# EAGLE design LB_BIT_p3_USBPOWER-v02(rev1) (EAGLE 6.6.0)
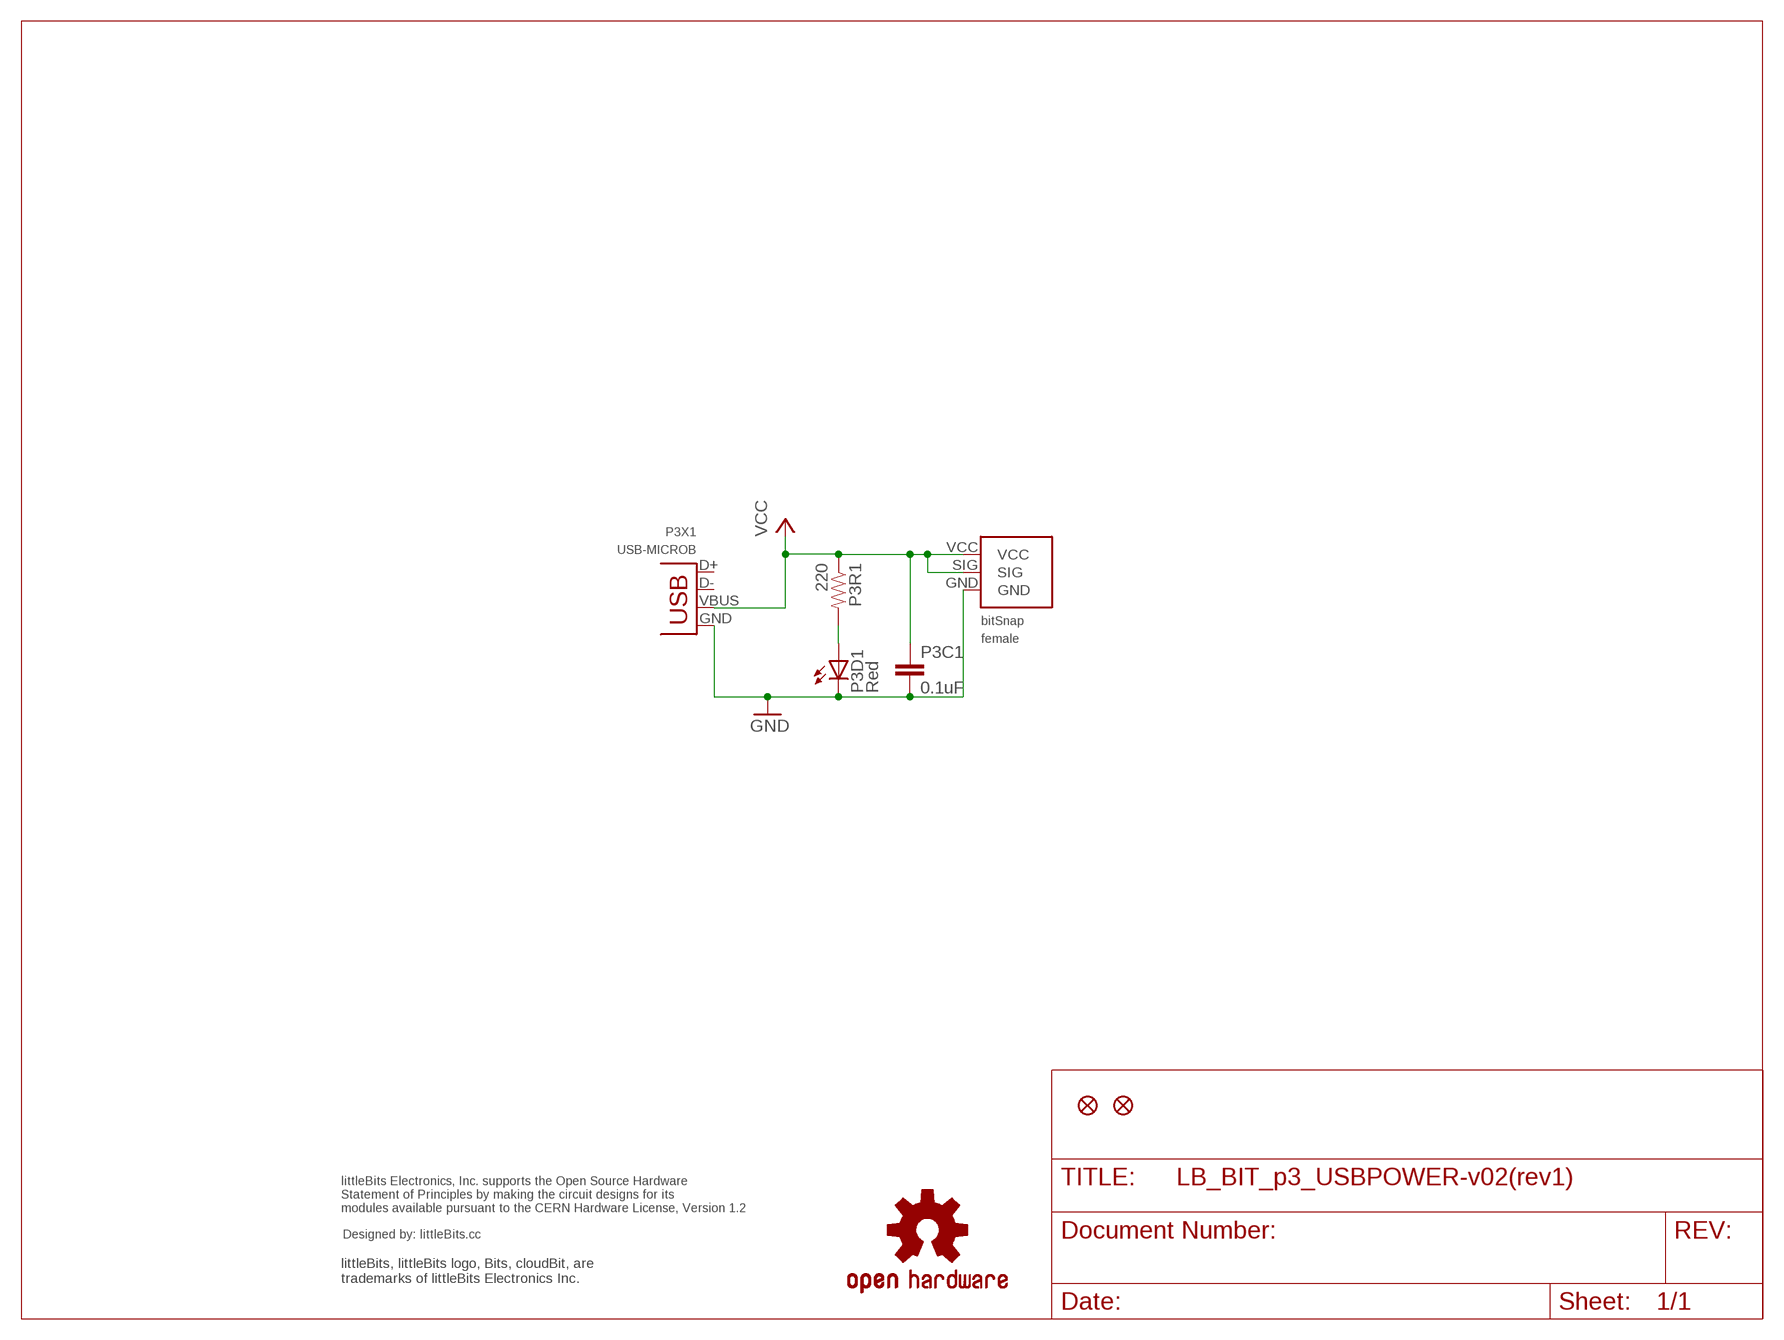
[diagram p0: schematic, sheet 1]

## Parts
P3BSF  BITSNAP_FEMALE  [BITSNAP_FEMALE]
P3C1  0.1uF  CAP0603-CAP  [0603-CAP]
P3D1  Red  LED1206  [LED-1206]
P3FD1  FIDUCIAL1X2  [FIDUCIAL-1X2]
P3FD2  FIDUCIAL1X2  [FIDUCIAL-1X2]
P3R1  220  RESISTOR0603-RES  [0603-RES]
P3X1  USB-MICROB  [USB-MICROB-ZX62-B-5PA(11)]
U$2  OSHWCREDIT  [OSHWCREDIT]
U$3  OSHW-LOGOL  [OSHW-LOGO-L]

## Nets
GND: P3BSF.GND P3C1.2 P3D1.C P3X1.GND
N$1: P3D1.A P3R1.2
VCC: P3BSF.SIG P3BSF.VCC P3C1.1 P3R1.1 P3X1.VBUS
Unconnected: P3X1.D+ P3X1.D-

## Library data of the parts
P3BSF = bitSnap:BITSNAP_FEMALE
P3C1 = SparkFun:CAP: Capacitor Standard 0603 ceramic capacitor, and 0.1" leaded capacitor.
P3D1 = SparkFun:LED: LEDs Standard schematic elements and footprints for 5mm, 3mm, 1206, and 0603 sized LEDs. 5mm - Spark Fun Electronics SKU : COM-00529 (and others)
P3FD1 P3FD2 = SparkFun:FIDUCIAL: Fiducial Alignment Points Various fiducial points for machine vision alignment.
P3R1 = SparkFun:RESISTOR: Resistor Basic schematic elements and footprints for 0603, 1206, and PTH 1/10th watt (small) resistors.
P3X1 = LITTLEBITS:USB-MICROB: Hirose Electric Co Ltd ZX62-B-5PA(11)
U$2 = LITTLEBITS:OSHWCREDIT
U$3 = SparkFun_NEW:OSHW-LOGO: Open Source Hardware Logo This logo indicates the piece of hardware it is found on incorporates a OSHW license and/or adheres to the definition of open source hardware found here: http://freedomdefined.org/OSHW

## Board
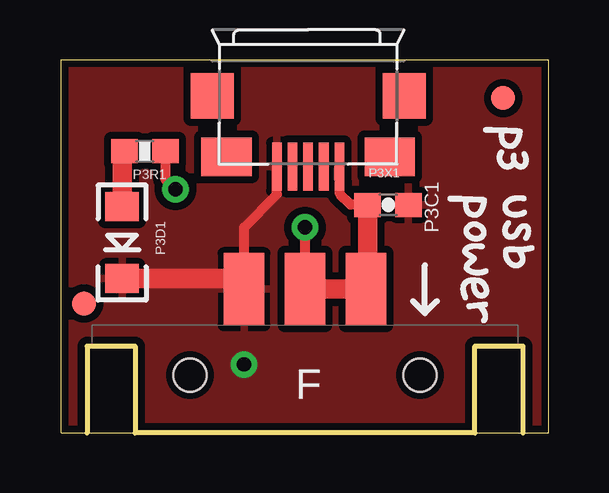
[diagram p1: board, top side]
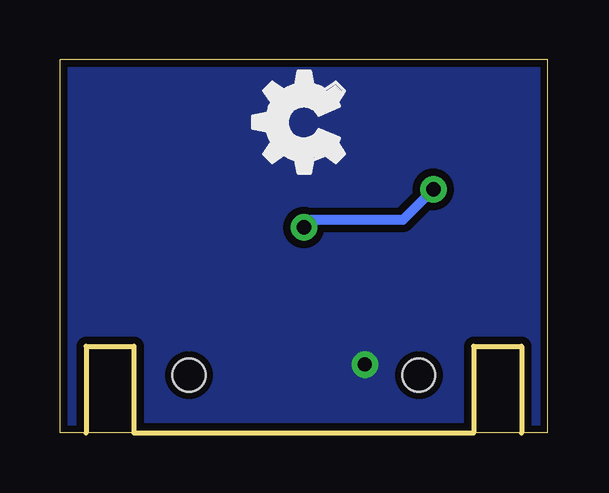
[diagram p2: board, bottom side, seen from below]

Size 20.32 x 15.56 mm. Coordinates in mm from the lower left corner, seen from the top.
Outline: 0,15.56 20.32,15.56 20.32,0 0,0 0,15.56
Copper layers (1*16): Top 0.035mm / dielectric 1.5mm / Bottom 0.035mm
Design rules "default": minimum track width 8mil, minimum drill 20mil, track to track 8mil, track to pad 8mil, pad to pad 8mil, via to via 8mil, smd to smd 8mil, copper to edge 10mil, drill to drill 8mil, minimum pad ring 12mil, minimum via ring 10mil, stop-mask expansion 4mil, vias tented up to drill 25mil, thermal gap 10mil

### Footprints (pad centres in the part's own frame; a part is rotated, then mirrored left to right if it is on the bottom)
BITSNAP_FEMALE = smd 1.7 x 3: GND 6.35,6; SIG 8.89,6; VCC 11.43,6 | hole 1.37: 13.68,2.41; 4.1,2.41
0603-CAP = smd 1.1 x 1: 1 -0.85,0; 2 0.85,0
LED-1206 = smd 1.2 x 1.4: A -1.5,0; C 1.5,0
FIDUCIAL-1X2 = smd 1 x 1: 1 0,0
0603-RES = smd 1.1 x 1: 1 -0.85,0; 2 0.85,0
USB-MICROB-ZX62-B-5PA(11) = smd 0.4 x 2: D+ 0,3.1; D- -0.65,3.1; GND 1.3,3.1; ID 0.65,3.1; VBUS -1.3,3.1 | smd 1.8 x 1.9: GND@2 -4,0.15; GND@3 4,0.15 | smd 2.1 x 1.6: P$1 -3.4,2.7; P$2 3.4,2.7

### Placement (x,y rotation side)
P3BSF  1.27,0 0 top
P3C1  13.62,9.51 0 top
P3D1  2.54,7.94 270 top
P3FD1  0.95,5.4 0 top
P3FD2  18.41,13.97 0 top
P3R1  3.49,11.75 180 top
P3X1  10.29,14.21 180 top
U$1  [P]  17.34,12.93 270 top
U$2  -16.51,-22.86 0 top  (outside the outline)
U$3  -12.7,-10.16 0 top  (outside the outline)
U$4  [OSHW_FILLX150_NOTEXT]  8.47,10 0 top
U$6  [3]  18.14,11.96 270 top
U$7  [U]  18.36,10.13 270 top
U$8  [S]  18.29,8.99 270 top
U$9  [B]  18.21,8 270 top
U$10  [P]  15.85,10.06 270 top
U$11  [O]  16.69,8.99 270 top
U$12  [W]  16.69,8.08 270 top
U$13  [E]  16.46,6.71 270 top
U$14  [R]  16.69,5.71 270 top

### Tracks (layer width: path | path; a pad name or v marks a point on that pad's centre or on a via)
GND  (via drill 0.6)
  Top 0.406: 7.18,6.44 7.62,6.88 7.62,8.57 8.99,9.95 P3X1.GND
  Top 0.813: P3D1.C 7.18,6.44 P3BSF.GND
  other vias: 7.62,2.86
  pour Top (isolate 0.305): 0.37,15.26 20,15.24 20,0.32 0.37,0.34
  pour Bottom (isolate 0.305): 0.32,15.24 20,15.24 20,0.32 0.32,0.32 0.32,10.79
N$1
  Top 0.813: P3D1.A 2.54,11.64 P3R1.2
VCC  (via drill 0.6)
  Top 0.406: P3X1.VBUS 11.62,9.97 12.06,9.53 12.76,9.53 12.76,9.51 P3C1.1 | P3R1.1 4.34,10.58 v4.76,10.16 | v10.16,8.57 P3BSF.SIG
  Top 0.813: P3BSF.SIG P3BSF.VCC 12.77,6.07 P3C1.1
  Bottom 0.406: v4.76,10.16 6.03,8.89 9.84,8.89 v10.16,8.57